# Altium schematic sheet 01.Power.SchDoc
size A4; DocumentNumber: 02; SheetNumber: 2; SheetTotal: 8; Page: Power
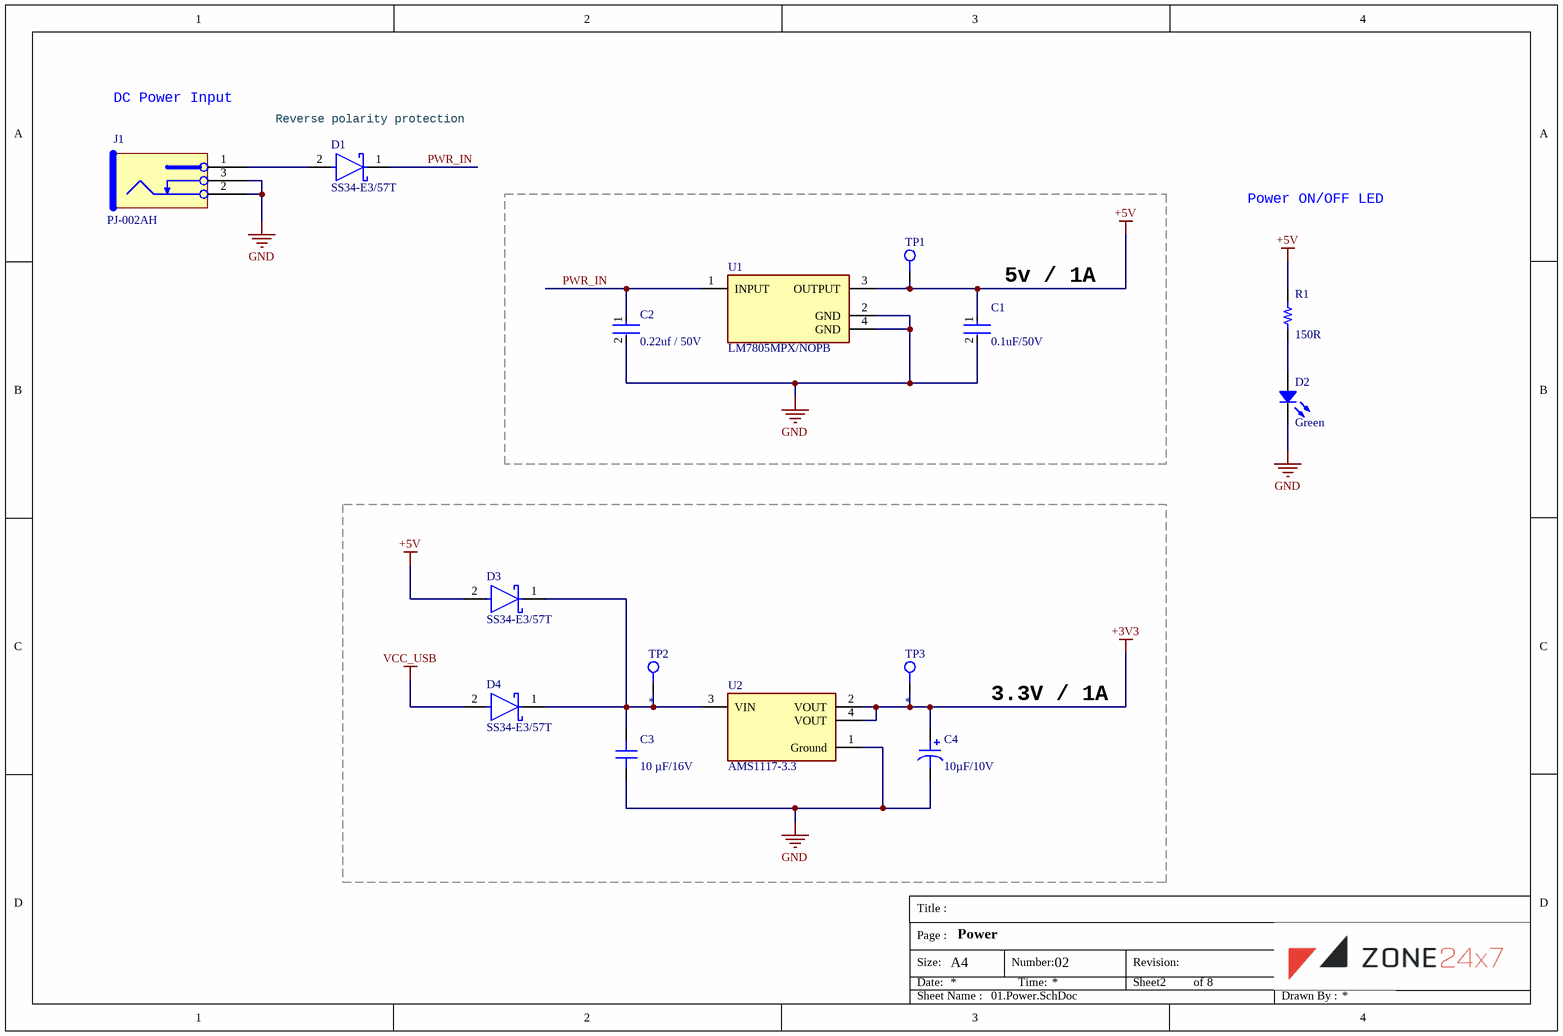
[diagram p0: 01.Power.SchDoc]

## Parts
C1  0.1uF/50V  [FP-RDE0M1-MFG]
C2  0.22uf / 50V  [FP-GRM31C-0_2-e0_3_0_8-IPC_B]
C3  10 µF/16V  [CAP 0603_1608]
C4  10µF/10V  [CAP POL 1411_3528]
D1  SS34-E3/57T  [FP-95402-MFG]
D2  Green  [LED 0805_2012 GREEN]
D3  SS34-E3/57T  [FP-95402-MFG]
D4  SS34-E3/57T  [FP-95402-MFG]
J1  PJ-002AH  [POWER_JACK_5.5_2.1MM_NS]
R1  150R  [RES 0603_1608]
TP1  *  [TP-2ED-1ID]
TP2  *  [TP-2ED-1ID]
TP3  *  [TP-2ED-1ID]
U1  LM7805MPX/NOPB  [FP-LM7805MPX-NOPB-MFG]
U2  AMS1117-3.3  [FP-AMS1117-IPC_C]

## Blocks framed on the sheet
5v / 1A: C1 C2 TP1 U1
3.3V / 1A: C3 C4 D3 D4 TP2 TP3 U2

## Nets
+3V3: C4.1 TP3.1 U2.2(VOUT) U2.4(VOUT)
+5V: C1.1 D3.2(A) R1.2 TP1.1 U1.3(OUTPUT)
GND: C1.2 C2.2 C3.1 C4.2 D2.2 J1.2 J1.3 U1.2(GND) U1.4(GND) U2.1(Ground)
VCC_USB: D4.2(A)
PWR_IN: C2.1 D1.1(C) U1.1(INPUT)
NetC3_2: C3.2 D3.1(C) D4.1(C) TP2.1 U2.3(VIN)
NetD1_2: D1.2(A) J1.1
NetD2_1: D2.1 R1.1

## Notes on the sheet
- DC Power Input
- (near D1) Reverse polarity protection
- Power ON/OFF LED
- Title :
- Size:
- Date:
- Page :
- A4
- Number:
- Time:
- Revision:
- Sheet
- of
- Sheet Name :
- Drawn By :

## Library data of the parts
C1 = CMP-06035-051680-1: ±10% 100nF 4mm 5.5mm 5mm 50V Radial Leaded,P=5mm Ceramic Disc Capacitors ROHS; Manufacturer Part Number: RDER71H104K0M1H03A; Value: 0.1uF/50V; JLC Part Number: C527620
C2 = CMP-06035-010316-1: 50V 220nF C0G ±5% 1206 Multilayer Ceramic Capacitors MLCC - SMD/SMT ROHS; Part Number: GRM31C5C1H224JE02L; Value: 0.22uf / 50V; JLC Part Number: C464977
C3 = GRT188R61C106ME13D: 16V 10uF X5R ±20% 0603 Multilayer Ceramic Capacitors MLCC - SMD/SMT ROHS; manufacturer: Murata Electronics; Manufacturer Part Number: GRT188R61C106ME13D; Value: 10 µF/16V; JLC Part Number: C2168010
C4 = TAJB106K010TNJ: 10uF 10V 2.1Ω@100kHz ±10% 1411 Tantalum Capacitors ROHS; manufacturer: AVX Corporation; Manufacturer Part Number: TAJB106K010TNJ; Value: 10µF/10V; JLC Part Number: C1953247
D1 D3 D4 = CMP-02539-000012-1: 40V 500mV@3A 3A SMC(DO-214AB) Schottky Barrier Diodes (SBD) ROHS; Manufacturer Part Number: SS34-E3/57T; JLC Part Number: C13354
D2 = 5975316507F: 无色透明透镜 570nm -40℃~+90℃ Green-yellow 120° 0805 Light Emitting Diodes (LED) ROHS; Manufacturer Part Number: E6C0805YGAC1UDA; Manufacturer: EKINGLUX; Current - Test: 20mA; Color: Green; JLC Part Number: C375456
J1 = PJ-002AH: CONN PWR JACK 2.1X5.5MM HIGH CUR; Manufacturer Part Number: PJ-002AH; JLC Part Number: C2961147
R1 = CRCW0603150RFKEA: 100mW Thick Film Resistors 100V ±1% ±100ppm/℃ -55℃~+155℃ 150Ω 0603 Chip Resistor - Surface Mount ROHS; Manufacturer: Vishay Dale; Manufacturer Part Number: CRCW0603150RFKEA; Value: 150R; JLC Part Number: C844741
TP1-TP3 = TP-2ED-1ID: Test point-via type 2mm External diameter  1mm internal diameter; Value: *
U1 = CMP-04917-000022-1: 80dB@(120Hz) 1.5A null 5V positive 35V SOT-223-4 Linear Voltage Regulators (LDO) ROHS; Manufacturer Part Number: LM7805MPX/NOPB; ComponentLink2Description: Datasheet; ComponentLink2URL: http://www.ti.com/lit/ds/symlink/lm7800.pdf; JLC Part Number: C2848241
U2 = CMP-209535-000001-1: SOT-223 Linear Voltage Regulators (LDO) ROHS; Manufacturer: Advanced Monolithic Systems; Manufacturer Part Number: AMS1117-3.3; JLC Part Number: C6186